# Altium project PCB_Project.PrjPcb
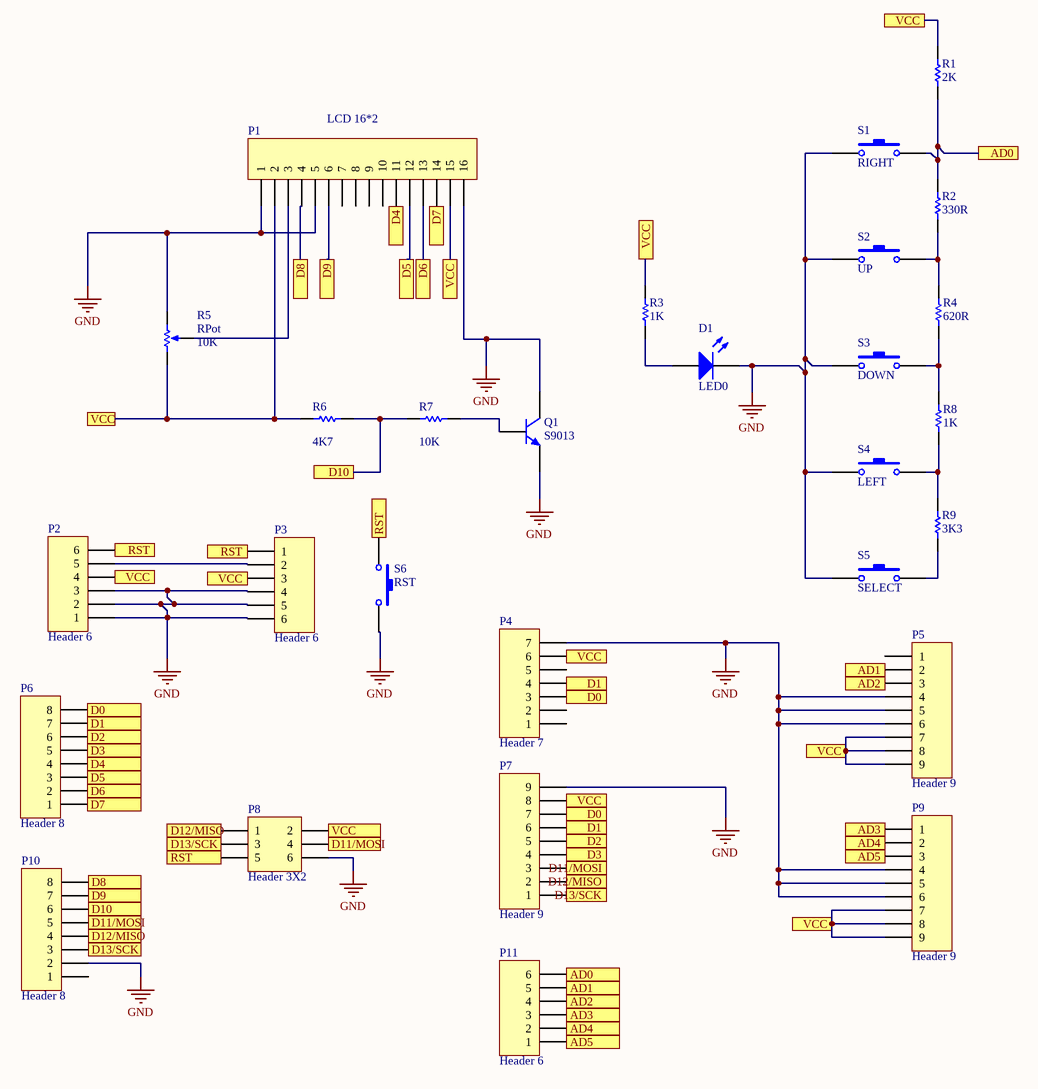
[diagram p0: Sheet1.SchDoc]
1 sheet, 28 parts. Net scope: flat (ports and power ports of the same name join across sheets).
Board file: PCB1.PcbDoc

## Sheet Sheet1.SchDoc
size Tabloid

### Parts
D1  LED0  [LED-0]
P1  LCD 16*2  [HDR1X16]
P2  Header 6  [HDR1X6]
P3  Header 6  [HDR1X6]
P4  Header 7  [HDR1X7]
P5  Header 9  [HDR1X9]
P6  Header 8  [HDR1X8]
P7  Header 9  [HDR1X9]
P8  Header 3X2  [HDR2X3]
P9  Header 9  [HDR1X9]
P10  Header 8  [HDR1X8]
P11  Header 6  [HDR1X6]
Q1  S9013  [TO-226-AA]
R1  value 2K  [AXIAL-0.3]
R2  value 330R  [AXIAL-0.3]
R3  value 1K  [RESC6332]
R4  value 620R  [AXIAL-0.3]
R5  RPot  value 10K  [VR5]
R6  value 4K7  [AXIAL-0.3]
R7  value 10K  [AXIAL-0.3]
R8  value 1K  [AXIAL-0.3]
R9  value 3K3  [AXIAL-0.3]
S1  RIGHT  [SPST-2]
S2  UP  [SPST-2]
S3  DOWN  [SPST-2]
S4  LEFT  [SPST-2]
S5  SELECT  [SPST-2]
S6  RST  [SPST-2]

### Ports
AD0, AD1, AD2, AD3, AD4, AD5, D0, D1, D2, D3, D4, D5, D6, D7, D8, D9, D10, D11/MOSI, D12/MISO, D13/SCK, RST, VCC

### Nets
GND: D1.2(K) P1.1 P1.5 P1.16 P2.1 P2.2 P2.3 P3.4 P3.5 P3.6 P4.7 P5.4 P5.5 P5.6 P7.9 P8.6 P9.4 P9.5 P9.6 P10.2 Q1.1(C) Q1.3(E) R5.2(BOT) S1.1 S2.1 S3.1 S4.1 S5.1 S6.2
NetD1_1: D1.1(A) R3.1
NetP1_2: P1.2 P1.15 P2.4 P3.3 P4.6 P5.7 P5.8 P5.9 P7.8 P8.2 P9.7 P9.8 P9.9 R1.2 R3.2 R5.1(TOP) R6.1 ; port VCC
NetP1_3: P1.3 R5.3(TAP)
NetP1_4: P1.4 P10.8 ; port D8
NetP1_6: P1.6 P10.7 ; port D9
NetP1_11: P1.11 P6.4 ; port D4
NetP1_12: P1.12 P6.3 ; port D5
NetP1_13: P1.13 P6.2 ; port D6
NetP1_14: P1.14 P6.1 ; port D7
NetP2_5: P2.5 P3.2
NetP2_6: P2.6 P3.1 P8.5 S6.1 ; port RST
NetP4_3: P4.3 P6.8 P7.7 ; port D0
NetP4_4: P4.4 P6.7 P7.6 ; port D1
NetP5_2: P5.2 P11.5 ; port AD1
NetP5_3: P5.3 P11.4 ; port AD2
NetP6_5: P6.5 P7.4 ; port D3
NetP6_6: P6.6 P7.5 ; port D2
NetP7_1: P7.1 P8.3 P10.3 ; port D13/SCK
NetP7_2: P7.2 P8.1 P10.4 ; port D12/MISO
NetP7_3: P7.3 P8.4 P10.5 ; port D11/MOSI
NetP9_1: P9.1 P11.3 ; port AD3
NetP9_2: P9.2 P11.2 ; port AD4
NetP9_3: P9.3 P11.1 ; port AD5
NetP10_6: P10.6 R6.2 R7.1 ; port D10
NetP11_6: P11.6 R1.1 R2.2 S1.2 ; port AD0
NetQ1_2: Q1.2(B) R7.2
NetR2_1: R2.1 R4.2 S2.2
NetR4_1: R4.1 R8.2 S3.2
NetR8_1: R8.1 R9.2 S4.2
NetR9_1: R9.1 S5.2

Not connected (* = marked no-connect by the designer): P1 7 8 9 10; P4 1 2 5; P5 1; P10 1

### Library data of the parts
D1 = LED0: Typical INFRARED GaAs LED; Published: 8-Jun-2000; LatestRevisionDate: 08-Jul-2005; LatestRevisionNote: Mech Layer 1 removed.; PackageReference: LED-0; Publisher: Altium Limited; PackageDescription: LED; 2 Leads
P1 = Header 16: Header, 16-Pin; LatestRevisionDate: 17-Jul-2002; LatestRevisionNote: Re-released for DXP Platform.; Publisher: Altium Limited
P2 P3 P11 = Header 6: Header, 6-Pin; LatestRevisionDate: 17-Jul-2002; LatestRevisionNote: Re-released for DXP Platform.; Publisher: Altium Limited
P4 = Header 7: Header, 7-Pin; LatestRevisionDate: 17-Jul-2002; LatestRevisionNote: Re-released for DXP Platform.; Publisher: Altium Limited
P5 P7 P9 = Header 9: Header, 9-Pin; LatestRevisionDate: 17-Jul-2002; LatestRevisionNote: Re-released for DXP Platform.; Publisher: Altium Limited
P6 P10 = Header 8: Header, 8-Pin; LatestRevisionDate: 17-Jul-2002; LatestRevisionNote: Re-released for DXP Platform.; Publisher: Altium Limited
P8 = Header 3X2: Header, 3-Pin, Dual row; LatestRevisionDate: 17-Jul-2002; LatestRevisionNote: Re-released for DXP Platform.; Publisher: Altium Limited
Q1 = NPN: NPN Bipolar Transistor; Published: 8-Jun-2000; LatestRevisionDate: 17-Jul-2002; LatestRevisionNote: Re-released for DXP Platform.; PackageReference: TO-226-AA; Publisher: Altium Limited; PackageDescription: TO, Flat Index; 3 In-Line, Axial Leads; Body Dia. 4.8mm; Leads 0.55 x 0.51 mm (max); Code_JEDEC: TO-226-AA
R1-R4 R6-R9 = Res1: Resistor; Published: 8-Jun-2000; LatestRevisionDate: 17-Jul-2002; LatestRevisionNote: Re-released for DXP Platform.; PackageReference: AXIAL-0.3; Publisher: Altium Limited; PackageDescription: Axial Device, Thru-Hole; 2 Leads; 0.3 in Pin Spacing
R5 = RPot: Potentiometer; Sim Note: Enter the Resistance value and the set point into parameter fields.; Set Position: 0.5; Published: 8-Jun-2000; LatestRevisionDate: 17-Jul-2002; LatestRevisionNote: Re-released for DXP Platform.; PackageReference: VR5; Publisher: Altium Limited; PackageDescription: Variable Resistor, Thru-Hole; 3 Leads
S1-S6 = SW-PB: Switch; Published: 24-Mar-1999; LatestRevisionDate: 17-Jul-2002; LatestRevisionNote: Re-released for DXP Platform.; PackageReference: SPST-2; Publisher: Altium Limited; PackageDescription: Switch; 2 Leads